# Altium schematic sheet ChargerSwitch.SchDoc
size A4; SheetNumber: 2; SheetTotal: 5
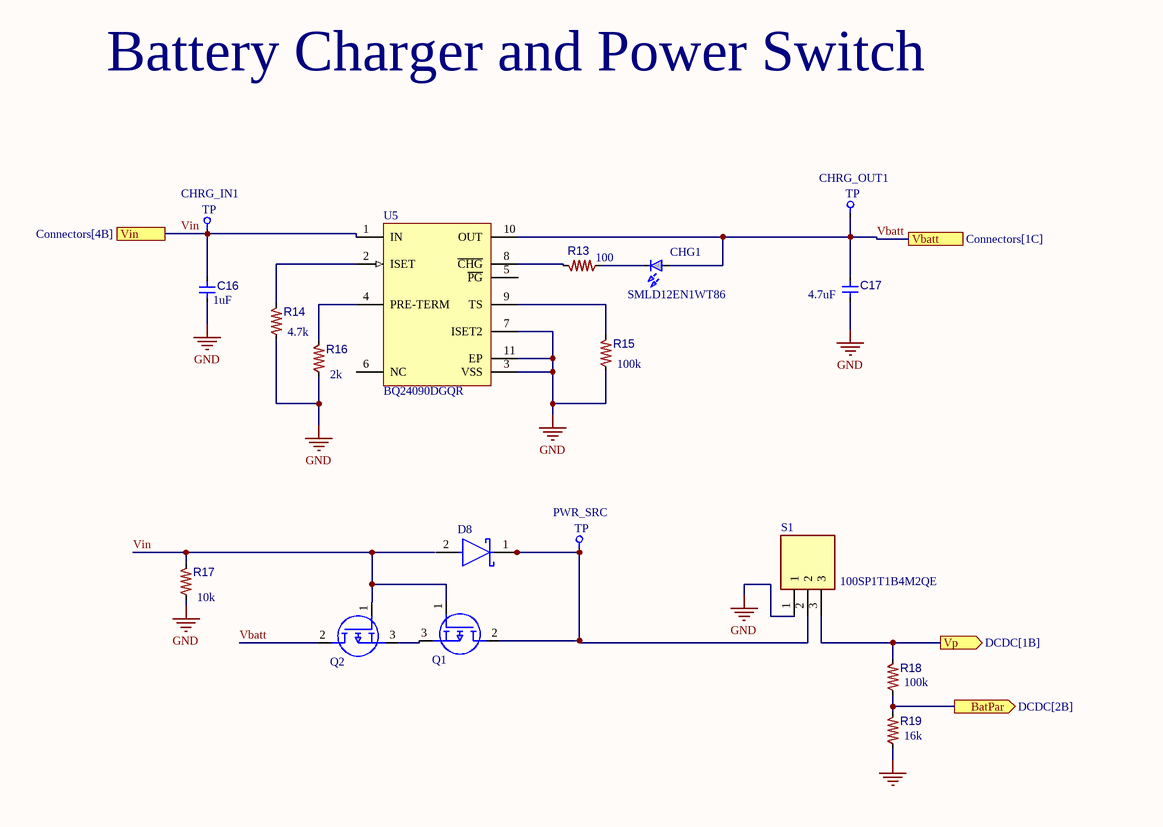
[diagram p0: ChargerSwitch.SchDoc]

## Parts
C16  C309479  [New footprint 1]  (value not drawn)
C17  C77045  [New footprint 1]  (value not drawn)
CHG1  SMLD12EN1WT86  [LEDM168X65N]
CHRG_IN1  Test Pad  [Test Pad-Footprint-1]  (value not drawn)
CHRG_OUT1  Test Pad  [Test Pad-Footprint-1]  (value not drawn)
D8  C191986  [FP-MBR1020VL_R1_00001-MFG]  (value not drawn)
PWR_SRC  Test Pad  [Test Pad-Footprint-1]  (value not drawn)
Q1  C113491  [TSM260P02CXRFG]  (value not drawn)
Q2  C113491  [TSM260P02CXRFG]  (value not drawn)
R13  C176127  [0603 resistor-Footprint-1]  (value not drawn)
R14  C116693  [0603 resistor-Footprint-1]  (value not drawn)
R15  C153133  [0603 resistor-Footprint-1]  (value not drawn)
R16  C105576  [0603 resistor-Footprint-1]  (value not drawn)
R17  C103210  [0603 resistor-Footprint-1]  (value not drawn)
R18  C153133  [0603 resistor-Footprint-1]  (value not drawn)
R19  C153133  [0603 resistor-Footprint-1]  (value not drawn)
S1  100SP1T1B4M2QE  [100SP1T1B4M2QE]
U5  BQ24090DGQR  [DGQ0010D_L]

## Ports
BatPar (out, see DCDC[2B]), Vbatt (see Connectors[1C]), Vin (see Connectors[4B]), Vp (out, see DCDC[1B])

## Nets
GND: C16.1 C17.1 R14.2 R15.2 R16.2 R17.2 R19.2 S1.1 U5.3(VSS) U5.7(ISET2) U5.11(EP)
BatPar: R18.2 R19.1 ; port BatPar
Vbatt: C17.2 CHG1.2(A) CHRG_OUT1.1 Q2.2(D) U5.10(OUT) ; port Vbatt
Vin: C16.2 CHRG_IN1.1 Q1.1(G) Q2.1(G) R17.1 U5.1(IN) ; port Vin
Vp: R18.1 S1.3 ; port Vp
NetCHG1_1: CHG1.1(K) R13.2
NetD8_1: D8.1(C) PWR_SRC.1 Q1.2(D) S1.2
NetQ1_3: Q1.3(S) Q2.3(S)
NetR13_1: R13.1 U5.8(~{CHG})
NetR14_1: R14.1 U5.2(ISET)
NetR15_1: R15.1 U5.9(TS)
NetR16_1: R16.1 U5.4(PRE-TERM)

Not connected (* = marked no-connect by the designer): D8 2(A); U5 5(~{PG}) 6(NC)

## Notes on the sheet
- Battery Charger and Power Switch
- (near R13) 100
- (near C16) 1uF
- 4.7k
- (near C17) 4.7uF
- (near R16) 2k
- (near R15) 100k
- (near R17) 10k
- (near R18) 100k
- (near R19) 16k
- (in symbol CMP-00030-00001-1) TP

## Library data of the parts
C16 = CMP-001-00083-1: 6.3V 1uF X7R ±10% 0603  Multilayer Ceramic Capacitors MLCC - SMD/SMT ROHS
C17 = CMP-001-00083-1: 116V 4.7uF X5R ±10% 0603 Multilayer Ceramic Capacitors MLCC - SMD/SMT ROHS
CHG1 = CMP-004-00034-1: Standard LEDs - SMD 1.6X0.8MM LOW CRNT; Manufacturer_Name: ROHM Semiconductor; Geometry.Height: 0.65mm; Datasheet Link: https://datasheet.datasheetarchive.com/originals/distributors/Datasheets_SAMA/8f824a900f8c9a143b1c3640e6aee7b7.pdf; Design Item ID: SMLD12EN1WT86; Manufacturer_Part_Number: SMLD12EN1WT86; Mouser Price/Stock: https://www.mouser.co.uk/ProductDetail/ROHM-Semiconductor/SMLD12EN1WT86?qs=qSfuJ%252Bfl%2Fd4fR%252B9yZydIwg%3D%3D; Mouser Part Number: 755-SMLD12EN1WT86; Source: SMLD12EN1WT86.SchLib
CHRG_IN1 CHRG_OUT1 PWR_SRC = CMP-00030-00001-1
D8 = CMP-34900-000005-1: 20V 340mV@1A 1A SOD-123F  Schottky Barrier Diodes (SBD) ROHS; RoHS Compliant: Yes
Q1 Q2 = CMP-010-000000-2: 20V 6.5A 1.4W 27mΩ@4.5V,6.5A N Channel SOT-23(TO-236)  MOSFETs ROHS; Manufacturer_Part_Number: TSM260P02CX RFG; Manufacturer_Name: Taiwan Semiconductor; Geometry.Height: 1.45mm; Mouser Price/Stock: https://www.mouser.co.uk/ProductDetail/Taiwan-Semiconductor/TSM260P02CX-RFG?qs=BZBei1rCqCB5JwyWPOdghw%3D%3D; Source: TSM260P02CX_RFG.SchLib; Design Item ID: TSM260P02CX_RFG; Datasheet Link: https://www.taiwansemi.com/assets/uploads/datasheet/TSM260P02_D1811.pdf; Mouser Part Number: 821-TSM260P02CXRFG
R13 = CMP-009-00177-1: 100mW Thick Film Resistors ±100ppm/℃ ±1% 100Ω 0603 Chip Resistor - Surface Mount ROHS
R14 = CMP-009-00177-1: 100mW ±100ppm/℃ ±1% 4.7kΩ 0603 Chip Resistor - Surface Mount ROHS
R15 R18 R19 = CMP-009-00177-1: 100mW Thick Film Resistors ±5% ±200ppm/℃ 100kΩ 0603 Chip Resistor - Surface Mount ROHS
R16 = CMP-009-00177-1: 100mW Thick Film Resistors ±100ppm/℃ ±1% 2kΩ 0603 Chip Resistor - Surface Mount ROHS
R17 = CMP-009-00177-1: 100mW Thick Film Resistors ±100ppm/℃ ±5% 10kΩ 0603 Chip Resistor - Surface Mount ROHS
S1 = CMP-011-00013-1: E-SWITCH - 100SP1T1B4M2QE - SWITCH; Datasheet Link: http://spec_sheets.e-switch.com/specs/T111597.pdf; Design Item ID: 100SP1T1B4M2QE; Height: 28mm; Mouser Part Number: 612-100-A1421; Source: SamacSys.SchLib; Manufacturer_Name: E-Switch; Mouser Price/Stock: https://www.mouser.co.uk/ProductDetail/E-Switch/100SP1T1B4M2QE?qs=YXf4ACKMM4xJ0mJK%2FyIa1g%3D%3D; Manufacturer_Part_Number: 100SP1T1B4M2QE
U5 = CMP-0321-00917-2: 6.45V 锂离子/Polymer 1 1A MSOP-10-EP  Battery Management ICs ROHS; Manufacturer: Texas Instruments; Over Voltage Protection: N; Eco-Plan: Green (RoHS & no Sb/Br); SubFamily: Battery Charge Management; Vin(Min)(V): 4.5; ComponentLink1URL: http://www.ti.com/general/docs/lit/getliterature.tsp?genericPartNumber=BQ24090&fileType=pdf; Lead Acid: N; PackageVersion: revF, Nov-2011; PackageReference: DGQ0010D; NiMH: N; Code_JEDEC: MO-187-BA-T; Mounting Technology: Surface Mount; Li-Polymer: N; PackageDescription: 10-Pin PowerPAD Plastic Small Outline 0.5 mm Pitch, Exposed Pad; PartNumber: BQ24090DGQR; NiCd: N; Li-Ion: N; ComponentLink1Description: Datasheet; DatasheetVersion: SLUS968C